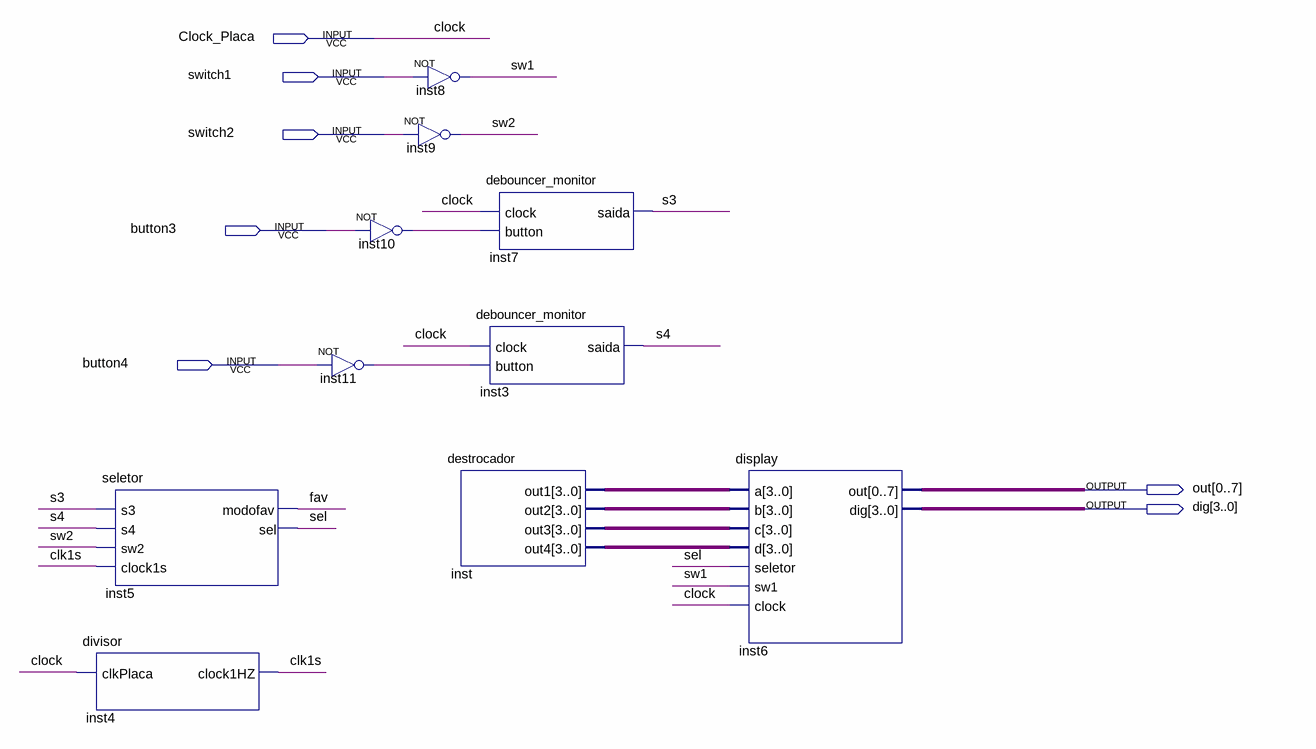
[diagram p0: schematic sheet]
// Quartus schematic testedivisao.bdf as structural Verilog: 10 symbols, 7 pins
module testedivisao (
  input  Clock_Placa,
  input  switch1,
  input  switch2,
  input  button3,
  input  button4,
  output [0:7] out,
  output [3:0] dig
);

  wire clk1s, fav, inst10_out, inst11_out, s3, s4, sel, sw1, sw2;
  wire [3:0] inst_out1, inst_out2, inst_out3, inst_out4;

  divisor inst4 (.clkPlaca(Clock_Placa), .clock1HZ(clk1s));
  seletor inst5 (.s3(s3), .s4(s4), .sw2(sw2), .clock1s(clk1s), .modofav(fav), .sel(sel));
  not inst11 (inst11_out, button4);
  not inst10 (inst10_out, button3);
  not inst8 (sw1, switch1);
  not inst9 (sw2, switch2);
  debouncer_monitor inst3 (.clock(Clock_Placa), .button(inst11_out), .saida(s4));
  destrocador inst (.out1(inst_out1), .out2(inst_out2), .out3(inst_out3), .out4(inst_out4));
  debouncer_monitor inst7 (.clock(Clock_Placa), .button(inst10_out), .saida(s3));
  display inst6 (
    .a(inst_out1), .b(inst_out2), .c(inst_out3), .d(inst_out4), .seletor(sel), .sw1(sw1),
    .clock(Clock_Placa), .out(out), .dig(dig));

  // Other names for the same wires on the sheet: clock = Clock_Placa
endmodule
